# Altium project SDR_PMR.PrjPcb (part 10 of 12)

## Sheet PTT.SchDoc
size A4; SheetNumber: 14; SheetTotal: 18
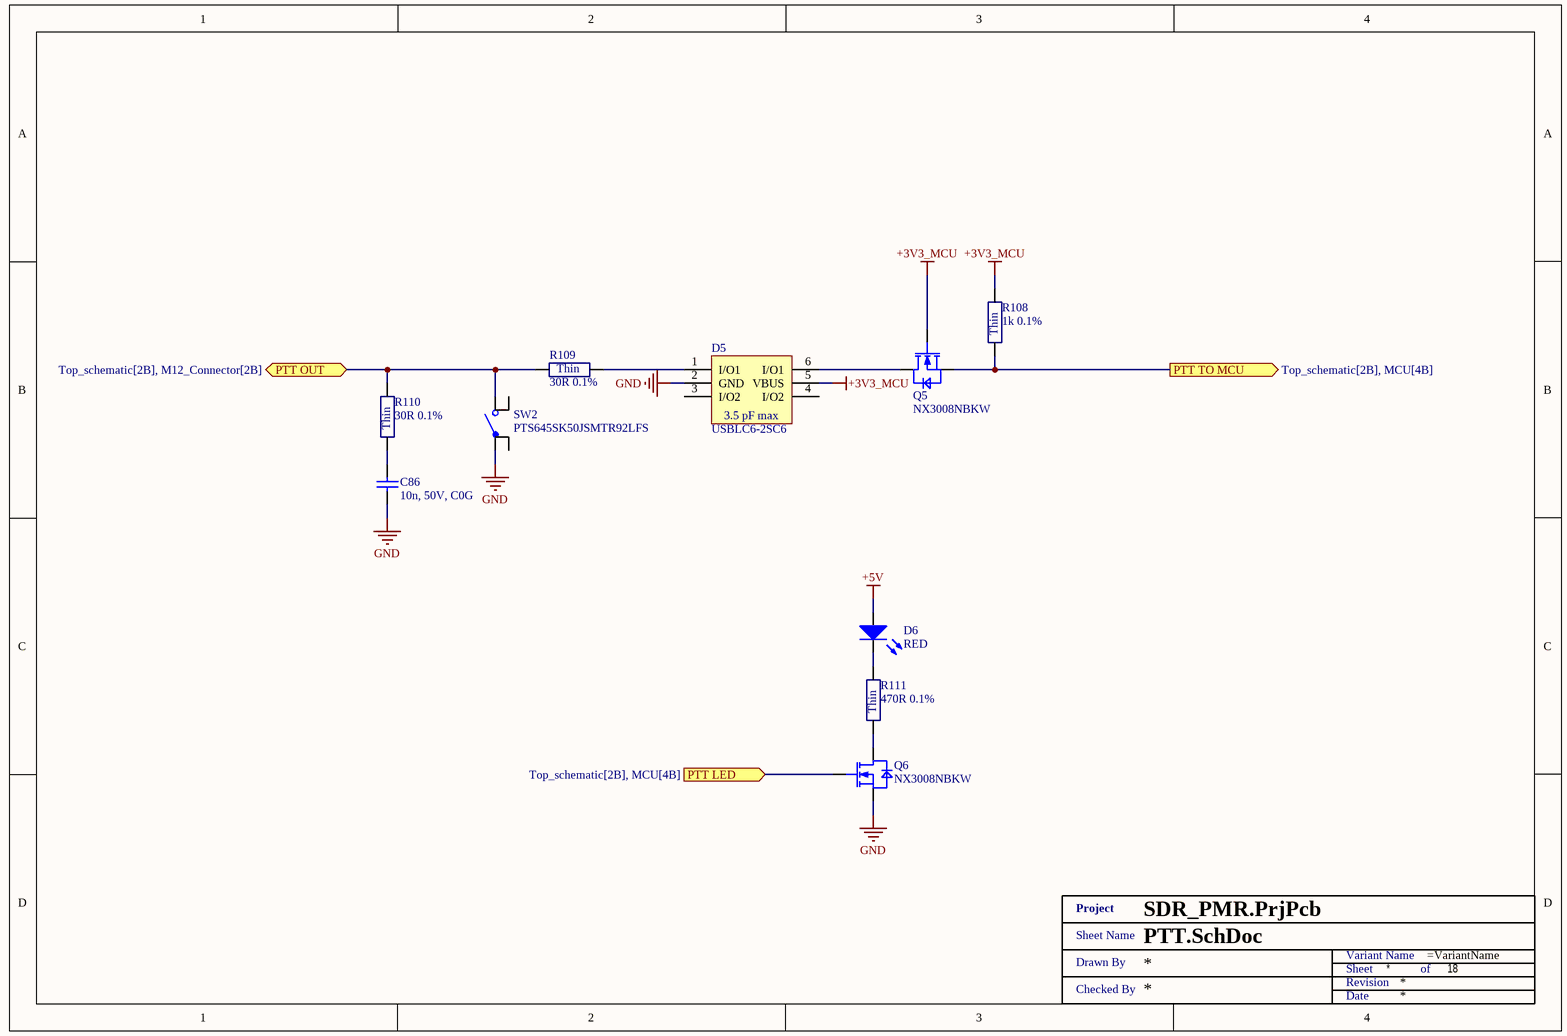
[diagram p13: PTT.SchDoc]

### Parts
(Parts that share a designator on the sheet are numbered #1, #2 ... from top to bottom, then left to right.)
C86  10n, 50V, C0G  [SMD0603]
D5  USBLC6-2SC6  [SOT23-6L]
D6  RED  [MCL-S270]
Q5  NX3008NBKW  [SOT323]
Q6  NX3008NBKW  [SOT323]
R108  1k 0.1%  [SMD0402 - R]
R109  30R 0.1%  [SMD0402 - R]
R110  30R 0.1%  [SMD0402 - R]
R111  470R 0.1%  [SMD0402 - R]
SW2  PTS645SK50JSMTR92LFS  [J Square Actuator 6X6]
XX?#14  Title 1  (value not drawn)  (graphical)

### Ports
PTT LED (in, see Top_schematic[2B], MCU[4B]), PTT OUT (bidir, see Top_schematic[2B], M12_Connector[2B]), PTT TO MCU (out, see Top_schematic[2B], MCU[4B])

### Nets
+3V3_MCU: D5.5(VBUS) Q5.1(G) R108.2
+5V: D6.2(A)
GND: C86.1 D5.2(GND) Q6.2(S) SW2.1(A)
NetC86_2: C86.2 R110.1
NetD5_1: D5.1(I/O1) R109.2
NetD5_6: D5.6(I/O1) Q5.3(D)
NetD6_1: D6.1(K) R111.2
NetQ5_2: Q5.2(S) R108.1 ; port PTT TO MCU
NetQ6_1: Q6.1(G) ; port PTT LED
NetQ6_3: Q6.3(D) R111.1
NetR109_1: R109.1 R110.2 SW2.3(C) ; port PTT OUT

Not connected (* = marked no-connect by the designer): D5 3(I/O2) 4(I/O2); SW2 2(B) 4(D)

### Notes on the sheet
- (in symbol RT0402BRE07470RL) Thin
- (in symbol TC0225B300JTCC) Thin
- (in symbol TC0225B1001TCC) Thin
- (in symbol Title 1) Project; Sheet Name; Variant Name; Drawn By; Sheet; of; Revision; Checked By; Date
- (in symbol USBLC6-2SC6) 3.5 pF max

### Library data of the parts
C86 = GRM1885C1H103JA01D: Multilayer Ceramic Capacitors MLCC - SMD/SMT 0603 50VDC 10000pF 5% C0G; Manufacturer: Murata Electronics; Type: Chip Multilayer Ceramic Capacitor for General Purpose; Capacitance - nF: 10 nF; Class: Class 1; CNHTS: 8532241000; Dielectric: C0G (NP0); TARIC: 8532240000; Supplier 1: Mouser; Supplier Part Number 1: 81-GRM1885C1H103JA1D; Manufacturer Part Number: GRM1885C1H103JA01D; RoHS: RoHS Compliant; Category: Multilayer Ceramic Capacitors MLCC - SMD/SMT; Stock 1: 217291; Pricing 1: 1=0.183, 10=0.129, 100=0.065, 500=0.045, 1000=0.039, 4000=0.030, 8000=0.027, 24000=0.025 (EUR); Capacitance: 10n; Height: 0.8 mm; Length: 1.6 mm; Package / Case: 0603 (1608 metric); Packaging: Cut Tape; Product: General Type MLCCs; Series: GRM; Termination Style: SMD/SMT; Tolerance: 5 %; Voltage Rating DC: 50 VDC; Width: 0.8 mm; Brand: Murata Electronics; Capacitance - pF: 10000 pF; Case Code - in: 0603; Case Code - mm: 1608; HTS Code: 8532240020; Maximum Operating Temperature: + 125 C; Minimum Operating Temperature: - 55 C; Product Type: Ceramic Capacitors; Standard Pack Qty: 4000; Subcategory: Capacitors; Termination: Standard; RoHS - Mouser: Y; Minimum Order Quantity: 1; Reeling: True; ComponentLink1URL: http://www.mouser.com/datasheet/2/281/murata_03052018_GRM_Series_1-1310166.pdf; ComponentLink1Description: http://www.mouser.com/datasheet/2/281/murata_03052018_GRM_Series_1-1310166.pdf; Supplier 2: Farnell; Supplier Part Number 2: 2456107
D5 = USBLC6-2SC6: STMicroelectronics Uni-Directional TVS Diode Array, 17V Vcl Max, SMD, SOT-23, 6V Vbr Min; Value: 2.5pF; Data Rate: 480Mbps; Direction: Unidirectional; Element Configuration: Dual; ESD Protection: Yes; Forward Voltage: 1.1V; Leakage Current: 150nA; Max Junction Temperature (Tj): 125°C; Max Repetitive Reverse Voltage (Vrrm): 5.25V; Number of Bidirectional Channels: 2; Number of Elements: 1; Peak Pulse Current: 5A; Reverse Standoff Voltage: 5V; Test Current: 1mA; Manufacturer: STMicroelectronics; Manufacturer Part Number: USBLC6-2SC6; RoHS: Compliant; Category: TVS Diodes; Pricing 1: 1=0.47, 10=0.292, 50=0.292, 100=0.204, 500=0.131, 1000=0.14, 3000=0.094, 6000=0.085, 9000=0.081, 10000=0.086, 24000=0.073 (USD); Breakdown Voltage: 6V; Case/Package: SOT-23; China RoHS: Compliant; Clamping Voltage: 17V; Contact Plating: Tin; Country of Origin: Mainland China; Depth: 1.75mm; Export Control Classification Number (ECCN) Code: EAR99; Height: 1.45mm; Harmonized Tariff Schedule (HTS) Code: 8541.10.00.50; Introduction Date: 2005-03-15; Lead Free: Lead Free; Length: 3.05mm; Lifecycle Status: Production; Max Breakdown Voltage: 6V; Max Operating Temperature: 125°C; Max Reverse Leakage Current: 150nA; Min Breakdown Voltage: 6V; Min Operating Temperature: -40°C; Mounting Technology: Surface Mount; Number of Channels: 2; Pins: 6; Number of Terminals: 6; Operating Supply Voltage: 1.1V; Peak Reverse Current: 150nA; Polarity: Unidirectional; Power Line Protection: Yes; Radiation Hardening: No; REACH SVHC: Yes; Reverse Breakdown Voltage: 6V; Schedule B: 8536300000, 8536300000|8536300000|8536300000|8536300000|8536300000|8536300000|8536300000|8536300000|8536300000|8536300000|8536300000|8536300000|8536300000|8536300000|8536300000|8536300000|8536300000|8536300000|8536300000|8536300000|8536300000|8536300000|8536300000|85; Termination: SMD/SMT; Width: 1.75mm; Working Voltage: 5V; ComponentLink1URL: https://datasheet.octopart.com:443/USBLC6-2SC6-STMicroelectronics-datasheet-10412581.pdf?src-supplier=Newark; ComponentLink1Description: https://datasheet.octopart.com:443/USBLC6-2SC6-STMicroelectronics-datasheet-10412581.pdf?src-supplier=Newark; ComponentLink2URL: https://datasheet.octopart.com:443/USBLC6-2SC6-STMicroelectronics-datasheet-181961833.pdf?src-supplier=Newark; ComponentLink2Description: https://datasheet.octopart.com:443/USBLC6-2SC6-STMicroelectronics-datasheet-181961833.pdf?src-supplier=Newark; ComponentLink3URL: https://datasheet.octopart.com:443/USBLC6-2SC6-STMicroelectronics-datasheet-525477.pdf?src-supplier=Factory+Futures; ComponentLink3Description: https://datasheet.octopart.com:443/USBLC6-2SC6-STMicroelectronics-datasheet-525477.pdf?src-supplier=Factory+Futures; ComponentLink4URL: https://datasheet.octopart.com:443/USBLC6-2SC6-STMicroelectronics-datasheet-82998616.pdf?src-supplier=Farnell; ComponentLink4Description: https://datasheet.octopart.com:443/USBLC6-2SC6-STMicroelectronics-datasheet-82998616.pdf?src-supplier=Farnell; ComponentLink5URL: https://datasheet.octopart.com:443/USBLC6-2SC6-STMicroelectronics-datasheet-46285.pdf?src-supplier=Farnell; ComponentLink5Description: https://datasheet.octopart.com:443/USBLC6-2SC6-STMicroelectronics-datasheet-46285.pdf?src-supplier=Farnell; ComponentLink6URL: https://datasheet.octopart.com:443/USBLC6-2SC6-STMicroelectronics-datasheet-14050643.pdf?src-supplier=iiiC; ComponentLink6Description: https://datasheet.octopart.com:443/USBLC6-2SC6-STMicroelectronics-datasheet-14050643.pdf?src-supplier=iiiC; ComponentLink7URL: https://datasheet.octopart.com:443/USBLC6-2SC6-STMicroelectronics-datasheet-10521292.pdf?src-supplier=Jameco+(USA); ComponentLink7Description: https://datasheet.octopart.com:443/USBLC6-2SC6-STMicroelectronics-datasheet-10521292.pdf?src-supplier=Jameco+(USA); Supplier 1: Mouser; Supplier Part Number 1: 511-USBLC6-2SC6; Supplier 2: LCSC; Supplier Part Number 2: C2687116
D6 = MCL-S270SRC: MULTICOMP - MCL-S270SRC - LED, SMD, 0805, SUPER-RED; Bulb Size: 1.25mm x 1.4; Forward Current If: 20; Forward Voltage: 1.85; Wavelength Typ: 643; Luminous Intensity: 17; Viewing Angle: 140°; Lens Shape: Rectangular; SVHC: No SVHC (17-Dec-2015); Forward Voltage VF Max: 2.4; LED / Lamp Size: 1.4mm x 1.25; LED Type: Standard; Luminous Intensity Min: 14; No. of Pins: 2; Peak Forward Current: 120; Peak Wavelength: 660; Power Dissipation Pd: 100; Reverse Protection Voltage: 5; Voltage Vf Min: 1.5; Voltage Vf Typ: 1.85V<!--FANDB--><div class="features-and-benefits-container"><div class="features-and-benefits-description"><span class="features-benefits-value">The MCL-S270SRC is a super red SMD LED with water clear epoxy, made of GaAlAs dice.</span></div><div class="features-and-benefits-list"><ul class="features-and-benefits-list-list"><li class="features-and-benefits-list-item">0805 Case</li><li class="features-and-benefits-list-item">5V Reverse voltage</li><li class="features-and-benefits-list-item">10?A at 5V Reverse current</li><li class="features-and-benefits-list-item">-40 to 85; Manufacturer: MULTICOMP; Manufacturer Part Number: MCL-S270SRC; RoHS: YES; Stock 1: 27404; Pricing 1: 5=0,154, 25=0,142, 100=0,132, 250=0,0847, 500=0,0679, 2000=0,0583, 5000=0,0521, 20000=0,0455 (GBP); LED Colour: Red; LED Mounting: SMD; Packaging: Cut Tape; Product Range: -; Automotive Qualification Standard: -; MSL: MSL 3 - 168 hours; Current Rating: 20; Dominant Wavelength: 643; Dominant Wavelength Typ: 643; Forward Current If Max: 20; Luminous Intensity Max: 20; Luminous Intensity Typ: 17; Operating Temperature Max: 85; Operating Temperature Min: -40; Operating Temperature Range: -40°C to +85; Storage Temperature Max: +100; Storage Temperature Min: -40; ComponentLink1URL: http://www.farnell.com/cad/53023.pdf; ComponentLink1Description: http://www.farnell.com/cad/53023.pdf; ComponentLink2URL: http://www.farnell.com/datasheets/2182724.pdf; ComponentLink2Description: http://www.farnell.com/datasheets/2182724.pdf; Supplier 1: Farnell; Supplier Part Number 1: 1581239; Supplier 2: Newark; Supplier Part Number 2: 14N9358
Q5 Q6 = NX3008NBKW: NXP - NX3008NBKW - MOSFET, N CH, 30V, 350MA, SOT323; Transistor Polarity: N Channel; Continuous Drain Current Id: 350; Drain Source Voltage Vds: 30; On Resistance Rds(on): 1; Rds(on) Test Voltage Vgs: 4.5; Threshold Voltage Vgs: 900; Power Dissipation Pd: 260; Transistor Case Style: SOT-323; No. of Pins: 3; SVHC: No SVHC (17-Dec-2015); Pulse Current Idm: -0.8; Voltage Vgs th Max: 8; Manufacturer: NXP; Manufacturer Part Number: NX3008NBKW; RoHS: YES; Stock 1: 4764; Pricing 1: 1=0.0425, 25=0.0385, 100=0.0347, 250=0.0334, 500=0.0312, 2000=0.0291, 4000=0.0282, 20000=0.0273 (GBP); Operating Temperature Max: 150; Product Range: -; Automotive Qualification Standard: -; MSL: MSL 1 - Unlimited; Operating Temperature Min: -55; Operating Temperature Range: -55°C to +150; ComponentLink1URL: http://www.farnell.com/datasheets/1508392.pdf; ComponentLink1Description: http://www.farnell.com/datasheets/1508392.pdf; Supplier 1: Mouser; Supplier Part Number 1: 771-NX3008NBKW,115; Supplier 2: Farnell; Supplier Part Number 2: 2069546; Supplier 3: Arrow; Supplier Part Number 3: NX3008NBKW,115
R108 = TC0225B1001TCC: 62.5mW Thin Film Resistor 25V ±25ppm/℃ ±0.1% 1kΩ 0402 Chip Resistor - Surface Mount ROHS; Manufacturer: Uniroyal; Working Voltage: 50V; Supplier 1: LCSC; Supplier Part Number 1: C2989674; Manufacturer Part Number: TC0225B1001TCC; Category: Chip SMD Resistors; Stock 1: 12060; Pricing 1: 20=0.036, 200=0.031, 600=0.0283, 2000=0.0267, 10000=0.0252, 20000=0.0245 (USD); Case/Package: 0402; Composition: Thin Film; Export Control Classification Number (ECCN) Code: EAR99; Height: 300µm; Harmonized Tariff Schedule (HTS) Code: 8533.21.00.30; Length: 1mm; Lifecycle Status: Production; Max Operating Temperature: 155°C; Min Operating Temperature: -55°C; Mounting Technology: Surface Mount; Number of Terminals: 2; Power Rating: 62.5mW; Resistance: 1k; Tolerance: 0.1%; Width: 500µm; ComponentLink1URL: https://datasheet.octopart.com:443/TC0225B1001TCC-Uniroyal-datasheet-194228365.pdf?src-supplier=LCSC; ComponentLink1Description: https://datasheet.octopart.com:443/TC0225B1001TCC-Uniroyal-datasheet-194228365.pdf?src-supplier=LCSC
R109 R110 = TC0225B300JTCC: as R88-R96 on sheet MCU; Supplier 1: LCSC; Supplier Part Number 1: C50670254; Manufacturer Part Number: TC0225B300JTCC; Category: Uncategorized; Stock 1: 4950; Pricing 1: 50=0.0203, 500=0.0161, 1500=0.0137, 10000=0.0123, 20000=0.0111, 50000=0.0104 (USD); ComponentLink1URL: https://datasheet.octopart.com:443/TC0225B300JTCC-Uniroyal-datasheet-194228366.pdf?src-supplier=LCSC; ComponentLink1Description: https://datasheet.octopart.com:443/TC0225B300JTCC-Uniroyal-datasheet-194228366.pdf?src-supplier=LCSC; Resistance: 30R
R111 = RT0402BRE07470RL: Fixed Resistor, Thin Film, 0.0625W, 470ohm, 50V, 0.1% +/-Tol, 50ppm/Cel, Surface Mount, 0402; Manufacturer: Yageo Group; Power Rating: 62.5mW; Temperature Coefficient: 50ppm/°C; Supplier: Mouser; Supplier Part Number: 603-RT0402BRE07470RL; Manufacturer Part Number: RT0402BRE07470RL; RoHS: Compliant; Category: Chip SMD Resistors; Pricing: 1=0,4, 10=0,205, 50=0,205, 100=0,121, 1000=0,079, 10000=0,052 (USD); Case/Package: 0402; Case Code (Metric): 0402; China RoHS: Non-Compliant; Composition: Thin Film; Country of Origin: Mainland China; Export Control Classification Number (ECCN) Code: EAR99; Height: 300µm; Harmonized Tariff Schedule (HTS) Code: 8533.21.00.30; Introduction Date: 2008-07-11; Lead Free: Lead Free; Length: 1mm; Lifecycle Status: Production; Max Operating Temperature: 155°C; Min Operating Temperature: -55°C; Mounting Technology: Surface Mount; Number of Terminals: 2; REACH SVHC: Yes; Resistance: 470R; Tolerance: 0.1%; Voltage Rating: 50V; Voltage Rating (DC): 50V; Width: 500µm; Working Voltage: 50V; ComponentLink1URL: https://datasheet.octopart.com:443/RT0402BRE07470RL-Yageo-datasheet-176402239.pdf?src-supplier=IHS; ComponentLink1Description: https://datasheet.octopart.com:443/RT0402BRE07470RL-Yageo-datasheet-176402239.pdf?src-supplier=IHS; ComponentLink2URL: https://datasheet.octopart.com:443/RT0402BRE07470RL-Yageo-datasheet-96443642.pdf?src-supplier=Upverter; ComponentLink2Description: https://datasheet.octopart.com:443/RT0402BRE07470RL-Yageo-datasheet-96443642.pdf?src-supplier=Upverter; ComponentLink3URL: https://datasheet.octopart.com:443/RT0402BRE07470RL-Yageo-Group-datasheet-188167888.pdf?src-supplier=LCSC; ComponentLink3Description: https://datasheet.octopart.com:443/RT0402BRE07470RL-Yageo-Group-datasheet-188167888.pdf?src-supplier=LCSC; ComponentLink4URL: https://datasheet.octopart.com:443/RT0402BRE07470RL-Yageo-Group-datasheet-141265893.pdf?src-supplier=ODG+(Origin+Data+Global); ComponentLink4Description: https://datasheet.octopart.com:443/RT0402BRE07470RL-Yageo-Group-datasheet-141265893.pdf?src-supplier=ODG+(Origin+Data+Global); ComponentLink5URL: https://datasheet.octopart.com/RT0402BRE07470RL-Yageo-datasheet-86813807.pdf; ComponentLink5Description: https://datasheet.octopart.com/RT0402BRE07470RL-Yageo-datasheet-86813807.pdf; ComponentLink6URL: http://sigma.octopart.com:80/conflict_mineral_statement/Yageo-company-3.pdf?src-supplier=Compliance+Statements; ComponentLink6Description: http://sigma.octopart.com:80/conflict_mineral_statement/Yageo-company-3.pdf?src-supplier=Compliance+Statements; ComponentLink7URL: http://sigma.octopart.com:80/rohs_statement/Yageo-company-2.pdf?src-supplier=Compliance+Statements; ComponentLink7Description: http://sigma.octopart.com:80/rohs_statement/Yageo-company-2.pdf?src-supplier=Compliance+Statements; Supplier 1: Mouser; Supplier Part Number 1: 603-RT0402BRE07470RL; Supplier 2: LCSC; Supplier Part Number 2: C853290
SW2 = PTS645SK50JSMTR92LFS: Switch Tactile SPST N.O Round Button 12V 50mA 2.5N Solder Surface Mount T/R; Manufacturer: C&K Components; Supplier: Mouser; Supplier Part Number: 611-SK50JSMTR92LFS; Manufacturer Part Number: PTS645SK50JSMTR92LFS; RoHS: Compliant; Category: Tactile Switches; Stock: 6240; Pricing: 1=0,51, 10=0,437, 50=0,408, 100=0,364, 1000=0,268, 10000=0,234 (USD); Export Control Classification Number (ECCN) Code: EAR99; Harmonized Tariff Schedule (HTS) Code: 8536.50.70.00; Introduction Date: 2022-04-14; Lifecycle Status: Production; REACH SVHC: Yes; ComponentLink1URL: https://datasheet.octopart.com:443/PTS645SK50JSMTR92LFS-C%26K-Components-datasheet-169841344.pdf?src-supplier=IHS; ComponentLink1Description: https://datasheet.octopart.com:443/PTS645SK50JSMTR92LFS-C%26K-Components-datasheet-169841344.pdf?src-supplier=IHS; ComponentLink2URL: https://datasheet.octopart.com:443/PTS645SK50JSMTR92LFS-C%26K-Components-datasheet-165782998.pdf?src-supplier=Farnell; ComponentLink2Description: https://datasheet.octopart.com:443/PTS645SK50JSMTR92LFS-C%26K-Components-datasheet-165782998.pdf?src-supplier=Farnell; ComponentLink3URL: https://datasheet.octopart.com:443/PTS645SK50JSMTR92LFS-C%26K-Components-datasheet-155912617.pdf?src-supplier=Sager+Electronics; ComponentLink3Description: https://datasheet.octopart.com:443/PTS645SK50JSMTR92LFS-C%26K-Components-datasheet-155912617.pdf?src-supplier=Sager+Electronics; ComponentLink4URL: https://datasheet.octopart.com:443/PTS645SK50JSMTR92LFS-C%26K-Components-datasheet-150821959.pdf?src-supplier=Sager+Electronics; ComponentLink4Description: https://datasheet.octopart.com:443/PTS645SK50JSMTR92LFS-C%26K-Components-datasheet-150821959.pdf?src-supplier=Sager+Electronics; ComponentLink5URL: https://datasheet.octopart.com:443/PTS645SK50JSMTR92LFS-C%26K-Components-datasheet-67873720.pdf?src-supplier=Sager+Electronics; ComponentLink5Description: https://datasheet.octopart.com:443/PTS645SK50JSMTR92LFS-C%26K-Components-datasheet-67873720.pdf?src-supplier=Sager+Electronics; ComponentLink6URL: http://sigma.octopart.com:80/reach_statement/ITT-company-18.pdf?src-supplier=Compliance+Statements; ComponentLink6Description: http://sigma.octopart.com:80/reach_statement/ITT-company-18.pdf?src-supplier=Compliance+Statements; Supplier 1: Mouser; Supplier Part Number 1: 611-SK50JSMTR92LFS; Supplier 2: Farnell; Supplier Part Number 2: PTS645SK50JSMTR92LFS

## Sheet USB_connector.SchDoc
size A4; SheetNumber: 16; SheetTotal: 18
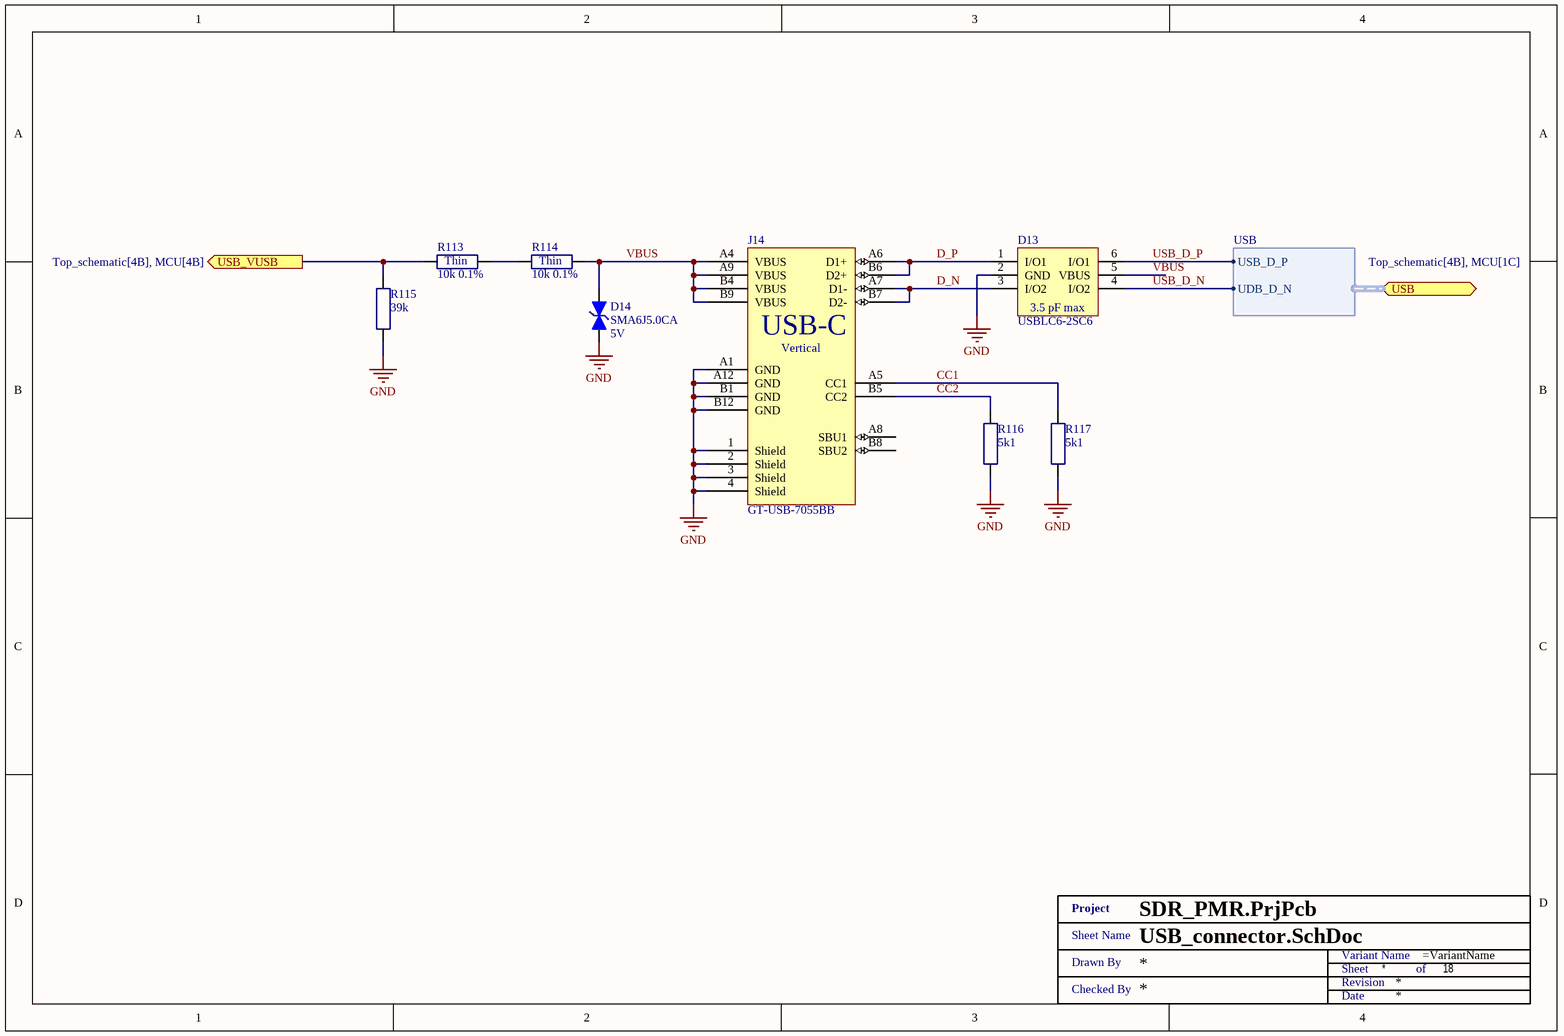
[diagram p14: USB_connector.SchDoc]

### Parts
(Parts that share a designator on the sheet are numbered #1, #2 ... from top to bottom, then left to right.)
D13  USBLC6-2SC6  [SOT23-6L]
D14  SMA6J5.0CA  Reverse Standoff Voltage: 5V  [DO-214AC]
J14  GT-USB-7055BB  [GT-USB-7055BB]
R113  10k 0.1%  [SMD0402 - R]
R114  10k 0.1%  [SMD0402 - R]
R115  39k  [SMD0402 - R]
R116  5k1  [SMD0402 - R]
R117  5k1  [SMD0402 - R]
XX?#15  Title 1  (value not drawn)  (graphical)

### Ports
USB (bidir, harness USB, see Top_schematic[4B], MCU[1C]), USB_VUSB (out, see Top_schematic[4B], MCU[4B])

### Harnesses
USB: UDB_D_N, USB_D_P

### Nets
GND: D13.2(GND) D14.1(A) J14.1(Shield) J14.2(Shield) J14.3(Shield) J14.4(Shield) J14.A1(GND) J14.A12(GND) J14.B1(GND) J14.B12(GND) R115.1 R116.1 R117.1
CC1: J14.A5(CC1) R117.2
CC2: J14.B5(CC2) R116.2
D_N: D13.3(I/O2) J14.A7(D1-) J14.B7(D2-)
D_P: D13.1(I/O1) J14.A6(D1+) J14.B6(D2+)
USB_D_N: D13.4(I/O2) ; port USB.UDB_D_N
USB_D_P: D13.6(I/O1) ; port USB.USB_D_P
USB_VUSB: R113.1 R115.2 ; port USB_VUSB
VBUS: D13.5(VBUS) D14.2(K) J14.A4(VBUS) J14.A9(VBUS) J14.B4(VBUS) J14.B9(VBUS) R114.2
NetR113_2: R113.2 R114.1

Not connected (* = marked no-connect by the designer): J14 A8(SBU1) B8(SBU2)

### Notes on the sheet
- (in symbol GT-USB-7055BB) USB-C; Vertical
- (in symbol TC0225B1002TCC) Thin
- (in symbol Title 1) Project; Sheet Name; Variant Name; Drawn By; Sheet; of; Revision; Checked By; Date
- (in symbol USBLC6-2SC6) 3.5 pF max

### Library data of the parts
D13 = USBLC6-2SC6: as D5 on sheet PTT; Manufacturer: STMicroelectronics; Manufacturer Part Number: USBLC6-2SC6; RoHS: Compliant; Category: TVS Diodes; Pricing 1: 1=0.47, 10=0.292, 50=0.292, 100=0.204, 500=0.131, 1000=0.14, 3000=0.094, 6000=0.085, 9000=0.081, 10000=0.086, 24000=0.073 (USD); Breakdown Voltage: 6V; Case/Package: SOT-23; China RoHS: Compliant; Clamping Voltage: 17V; Contact Plating: Tin; Country of Origin: Mainland China; Depth: 1.75mm; Export Control Classification Number (ECCN) Code: EAR99; Height: 1.45mm; Harmonized Tariff Schedule (HTS) Code: 8541.10.00.50; Introduction Date: 2005-03-15; Lead Free: Lead Free; Length: 3.05mm; Lifecycle Status: Production; Max Breakdown Voltage: 6V; Max Operating Temperature: 125°C; Max Reverse Leakage Current: 150nA; Min Breakdown Voltage: 6V; Min Operating Temperature: -40°C; Mounting Technology: Surface Mount; Number of Channels: 2; Pins: 6; Number of Terminals: 6; Operating Supply Voltage: 1.1V; Peak Reverse Current: 150nA; Polarity: Unidirectional; Power Line Protection: Yes; Radiation Hardening: No; REACH SVHC: Yes; Reverse Breakdown Voltage: 6V; Schedule B: 8536300000, 8536300000|8536300000|8536300000|8536300000|8536300000|8536300000|8536300000|8536300000|8536300000|8536300000|8536300000|8536300000|8536300000|8536300000|8536300000|8536300000|8536300000|8536300000|8536300000|8536300000|8536300000|8536300000|8536300000|85; Termination: SMD/SMT; Width: 1.75mm; Working Voltage: 5V; ComponentLink1URL: https://datasheet.octopart.com:443/USBLC6-2SC6-STMicroelectronics-datasheet-10412581.pdf?src-supplier=Newark; ComponentLink1Description: https://datasheet.octopart.com:443/USBLC6-2SC6-STMicroelectronics-datasheet-10412581.pdf?src-supplier=Newark; ComponentLink2URL: https://datasheet.octopart.com:443/USBLC6-2SC6-STMicroelectronics-datasheet-181961833.pdf?src-supplier=Newark; ComponentLink2Description: https://datasheet.octopart.com:443/USBLC6-2SC6-STMicroelectronics-datasheet-181961833.pdf?src-supplier=Newark; ComponentLink3URL: https://datasheet.octopart.com:443/USBLC6-2SC6-STMicroelectronics-datasheet-525477.pdf?src-supplier=Factory+Futures; ComponentLink3Description: https://datasheet.octopart.com:443/USBLC6-2SC6-STMicroelectronics-datasheet-525477.pdf?src-supplier=Factory+Futures; ComponentLink4URL: https://datasheet.octopart.com:443/USBLC6-2SC6-STMicroelectronics-datasheet-82998616.pdf?src-supplier=Farnell; ComponentLink4Description: https://datasheet.octopart.com:443/USBLC6-2SC6-STMicroelectronics-datasheet-82998616.pdf?src-supplier=Farnell; ComponentLink5URL: https://datasheet.octopart.com:443/USBLC6-2SC6-STMicroelectronics-datasheet-46285.pdf?src-supplier=Farnell; ComponentLink5Description: https://datasheet.octopart.com:443/USBLC6-2SC6-STMicroelectronics-datasheet-46285.pdf?src-supplier=Farnell; ComponentLink6URL: https://datasheet.octopart.com:443/USBLC6-2SC6-STMicroelectronics-datasheet-14050643.pdf?src-supplier=iiiC; ComponentLink6Description: https://datasheet.octopart.com:443/USBLC6-2SC6-STMicroelectronics-datasheet-14050643.pdf?src-supplier=iiiC; ComponentLink7URL: https://datasheet.octopart.com:443/USBLC6-2SC6-STMicroelectronics-datasheet-10521292.pdf?src-supplier=Jameco+(USA); ComponentLink7Description: https://datasheet.octopart.com:443/USBLC6-2SC6-STMicroelectronics-datasheet-10521292.pdf?src-supplier=Jameco+(USA); Supplier 1: Mouser; Supplier Part Number 1: 511-USBLC6-2SC6; Supplier 2: LCSC; Supplier Part Number 2: C2687116
D14 = SMA6J5.0CA: ESD Suppressors / TVS Diodes 600W 5V 5% Bi-Directional; Manufacturer: Littelfuse; Supplier 1: Mouser; Supplier Part Number 1: 576-SMA6J5.0CA; Manufacturer Part Number: SMA6J5.0CA; RoHS: Yes; Category: TVS Diodes; Stock 1: 57321; Pricing 1: 1=0.41, 10=0.35, 50=0.35, 100=0.243, 1000=0.139, 10000=0.115 (USD); ComponentLink1URL: http://www.farnell.com/datasheets/2736094.pdf?src-supplier=Farnell; ComponentLink1Description: http://www.farnell.com/datasheets/2736094.pdf?src-supplier=Farnell; ComponentLink2URL: https://datasheet.octopart.com/SMA6J5.0CA-Littelfuse-datasheet-114785799.pdf?src-supplier=Future+Electronics; ComponentLink2Description: https://datasheet.octopart.com/SMA6J5.0CA-Littelfuse-datasheet-114785799.pdf?src-supplier=Future+Electronics; ComponentLink3URL: https://www.littelfuse.com/~/media/electronics/datasheets/tvs_diodes/littelfuse_tvs_diode_sma6j_datasheet.pdf.pdf?src-supplier=Digi-Key; ComponentLink3Description: https://www.littelfuse.com/~/media/electronics/datasheets/tvs_diodes/littelfuse_tvs_diode_sma6j_datasheet.pdf.pdf?src-supplier=Digi-Key; ComponentLink4URL: http://www.farnell.com/datasheets/2736094.pdf?src-supplier=Newark; ComponentLink4Description: http://www.farnell.com/datasheets/2736094.pdf?src-supplier=Newark; ComponentLink5URL: http://www.farnell.com/datasheets/2736094.pdf?src-supplier=Element14; ComponentLink5Description: http://www.farnell.com/datasheets/2736094.pdf?src-supplier=Element14; Supplier 2: Farnell; Supplier Part Number 2: 3010381; Supplier 3: Digi-Key; Supplier Part Number 3: 18-SMA6J5.0CACT-ND
J14 = GT-USB-7055BB: CONN RCPT USB 2.0 Type-C 16POS SMD; Supplier 1: LCSC; Supplier Part Number 1: C7450621
R113 R114 = TC0225B1002TCC: Fixed Resistor, Thin Film, 0.0625W, 10000ohm, 50V, 0.1% +/-Tol, Surface Mount, 0402; Manufacturer: Uniroyal; Power Rating: 62.5mW; Supplier 1: LCSC; Supplier Part Number 1: C2989267; Manufacturer Part Number: TC0225B1002TCC; Category: Chip SMD Resistors; Stock 1: 10200; Pricing 1: 20=0.0396, 200=0.0352, 600=0.0327, 2000=0.0312, 10000=0.0299, 20000=0.0292 (USD); Case/Package: 0402; Composition: Thin Film; Export Control Classification Number (ECCN) Code: EAR99; Height: 300µm; Harmonized Tariff Schedule (HTS) Code: 8533.21.00.30; Length: 1mm; Lifecycle Status: Production; Max Operating Temperature: 155°C; Min Operating Temperature: -55°C; Mounting Technology: Surface Mount; Number of Terminals: 2; Resistance: 10k; Tolerance: 0.1%; Width: 500µm; Working Voltage: 50V; ComponentLink1URL: https://datasheet.octopart.com:443/TC0225B1002TCC-Uniroyal-datasheet-194228365.pdf?src-supplier=LCSC; ComponentLink1Description: https://datasheet.octopart.com:443/TC0225B1002TCC-Uniroyal-datasheet-194228365.pdf?src-supplier=LCSC
R115 = RC0402FR-0739KL: Res Thick Film 0402 39K Ohm 1% 0.063W(1/16W) ±100ppm/C Pad SMD T/R; Manufacturer: Yageo Group; Max Power Dissipation: 63mW; Power Rating: 62.5mW; Temperature Coefficient: 100ppm/°C; Voltage Rating: 50V; Supplier 1: Mouser; Supplier Part Number 1: 603-RC0402FR-0739KL; Manufacturer Part Number: RC0402FR-0739KL; RoHS: Compliant; Category: Chip SMD Resistors; Stock 1: 313189; Pricing 1: 1=0.1, 10=0.011, 50=0.011, 100=0.006, 1000=0.006, 10000=0.002 (USD); Case/Package: 0402; Case Code (Imperial): 0402; China RoHS: Non-Compliant; Composition: Thick Film; Depth: 500µm; Features: Moisture Resistant; Height: 350µm; Lead Free: Lead Free; Length: 1mm; Lifecycle Status: Production; Max Operating Temperature: 155°C; Military Standard: Not; Min Operating Temperature: -55°C; Mounting Technology: Surface Mount; Pins: 2; Number of Terminals: 2; Number of Terminations: 2; REACH SVHC: Yes; Resistance: 39k; Schedule B: 8533210045, 8533210045|8533210045, 8533210045|8533210045|8533210045, 8533210045|8533210045|8533210045|8533210045; Termination: SMD/SMT; Tolerance: 1%; Voltage Rating (AC): 50V; Voltage Rating (DC): 50V; Width: 500µm; Working Voltage: 50V; ComponentLink1URL: https://datasheet.octopart.com:443/RC0402FR-0739KL-Yageo-datasheet-175887523.pdf?src-supplier=IHS; ComponentLink1Description: https://datasheet.octopart.com:443/RC0402FR-0739KL-Yageo-datasheet-175887523.pdf?src-supplier=IHS; ComponentLink2URL: https://datasheet.octopart.com:443/RC0402FR-0739KL-Yageo-datasheet-103092701.pdf?src-supplier=Upverter; ComponentLink2Description: https://datasheet.octopart.com:443/RC0402FR-0739KL-Yageo-datasheet-103092701.pdf?src-supplier=Upverter; ComponentLink3URL: https://datasheet.octopart.com:443/RC0402FR-0739KL-Yageo-Group-datasheet-190305687.pdf?src-supplier=Newark; ComponentLink3Description: https://datasheet.octopart.com:443/RC0402FR-0739KL-Yageo-Group-datasheet-190305687.pdf?src-supplier=Newark; ComponentLink4URL: https://datasheet.octopart.com:443/RC0402FR-0739KL-Yageo-datasheet-8324527.pdf?src-supplier=Newark; ComponentLink4Description: https://datasheet.octopart.com:443/RC0402FR-0739KL-Yageo-datasheet-8324527.pdf?src-supplier=Newark; ComponentLink5URL: https://datasheet.octopart.com:443/RC0402FR-0739KL-Yageo-datasheet-10408619.pdf?src-supplier=element14+APAC; ComponentLink5Description: https://datasheet.octopart.com:443/RC0402FR-0739KL-Yageo-datasheet-10408619.pdf?src-supplier=element14+APAC; ComponentLink6URL: https://datasheet.octopart.com:443/RC0402FR-0739KL-Yageo-datasheet-62067350.pdf?src-supplier=element14+APAC; ComponentLink6Description: https://datasheet.octopart.com:443/RC0402FR-0739KL-Yageo-datasheet-62067350.pdf?src-supplier=element14+APAC; ComponentLink7URL: https://datasheet.octopart.com:443/RC0402FR-0739KL-Yageo-datasheet-176638170.pdf?src-supplier=Future+Electronics; ComponentLink7Description: https://datasheet.octopart.com:443/RC0402FR-0739KL-Yageo-datasheet-176638170.pdf?src-supplier=Future+Electronics; ComponentLink8URL: https://datasheet.octopart.com:443/RC0402FR-0739KL-Yageo-datasheet-164759695.pdf?src-supplier=Future+Electronics; ComponentLink8Description: https://datasheet.octopart.com:443/RC0402FR-0739KL-Yageo-datasheet-164759695.pdf?src-supplier=Future+Electronics; ComponentLink9URL: https://datasheet.octopart.com:443/RC0402FR-0739KL-Yageo-datasheet-137700087.pdf?src-supplier=Future+Electronics; ComponentLink9Description: https://datasheet.octopart.com:443/RC0402FR-0739KL-Yageo-datasheet-137700087.pdf?src-supplier=Future+Electronics; ComponentLink10URL: https://datasheet.octopart.com:443/RC0402FR-0739KL-Yageo-datasheet-12531192.pdf?src-supplier=Future+Electronics; ComponentLink10Description: https://datasheet.octopart.com:443/RC0402FR-0739KL-Yageo-datasheet-12531192.pdf?src-supplier=Future+Electronics; ComponentLink11URL: https://datasheet.octopart.com:443/RC0402FR-0739KL-Yageo-datasheet-148775077.pdf?src-supplier=TME; ComponentLink11Description: https://datasheet.octopart.com:443/RC0402FR-0739KL-Yageo-datasheet-148775077.pdf?src-supplier=TME; ComponentLink12URL: https://datasheet.octopart.com:443/RC0402FR-0739KL-Yageo-datasheet-79472498.pdf?src-supplier=Megastar; ComponentLink12Description: https://datasheet.octopart.com:443/RC0402FR-0739KL-Yageo-datasheet-79472498.pdf?src-supplier=Megastar; ComponentLink13URL: https://datasheet.octopart.com/RC0402FR-0739KL-Yageo-datasheet-73766026.pdf; ComponentLink13Description: https://datasheet.octopart.com/RC0402FR-0739KL-Yageo-datasheet-73766026.pdf; ComponentLink14URL: https://datasheet.octopart.com:443/RC0402FR-0739KL-Yageo-datasheet-8329306.pdf?src-supplier=element14; ComponentLink14Description: https://datasheet.octopart.com:443/RC0402FR-0739KL-Yageo-datasheet-8329306.pdf?src-supplier=element14; ComponentLink15URL: http://sigma.octopart.com:80/conflict_mineral_statement/Yageo-company-3.pdf?src-supplier=Compliance+Statements; ComponentLink15Description: http://sigma.octopart.com:80/conflict_mineral_statement/Yageo-company-3.pdf?src-supplier=Compliance+Statements; ComponentLink16URL: http://sigma.octopart.com:80/rohs_statement/Yageo-company-2.pdf?src-supplier=Compliance+Statements; ComponentLink16Description: http://sigma.octopart.com:80/rohs_statement/Yageo-company-2.pdf?src-supplier=Compliance+Statements; Supplier Part Number 2: C137995; Supplier 2: LCSC
R116 R117 = RC0402FR-075K1L: 62.5mW Thick Film Resistors 50V ±100ppm/℃ ±1% 5.1kΩ 0402 Chip Resistor - Surface Mount ROHS; Manufacturer: Yageo Group; Max Power Dissipation: 63mW; Temperature Coefficient: 100ppm/°C; Supplier 1: Mouser; Supplier Part Number 1: 603-RC0402FR-075K1L; Manufacturer Part Number: RC0402FR-075K1L; RoHS: Compliant; Category: Chip SMD Resistors; Stock 1: 189513; Pricing 1: 1=0.1, 10=0.009, 50=0.009, 100=0.007, 1000=0.006, 10000=0.002 (USD); Case/Package: 0402; Case Code (Imperial): 0402; China RoHS: Non-Compliant; Composition: Thick Film; Country of Origin: Mainland China, Taiwan; Depth: 500µm; Export Control Classification Number (ECCN) Code: EAR99; Features: Moisture Resistant; Height: 350µm; Harmonized Tariff Schedule (HTS) Code: 8533.21.00.30; Introduction Date: 2008-07-18; Lead Free: Lead Free; Length: 1mm; Lifecycle Status: Production; Max Operating Temperature: 155°C; Military Standard: Not; Min Operating Temperature: -55°C; Mounting Technology: Surface Mount; Pins: 2; Number of Terminals: 2; Number of Terminations: 2; Packaging: Cut Tape; Power Rating: 62.5mW; REACH SVHC: Yes; Resistance: 5k1; Schedule B: 8533210045, 8533210045|8533210045, 8533210045|8533210045|8533210045, 8533210045|8533210045|8533210045|8533210045; Termination: SMD/SMT; Tolerance: 1%; Voltage Rating: 50V; Voltage Rating (DC): 50V; Width: 500µm; Working Voltage: 50V; ComponentLink1URL: https://datasheet.octopart.com:443/RC0402FR-075K1L-Yageo-datasheet-175887523.pdf?src-supplier=IHS; ComponentLink1Description: https://datasheet.octopart.com:443/RC0402FR-075K1L-Yageo-datasheet-175887523.pdf?src-supplier=IHS; ComponentLink2URL: https://datasheet.octopart.com:443/RC0402FR-075K1L-Yageo-datasheet-103092701.pdf?src-supplier=Upverter; ComponentLink2Description: https://datasheet.octopart.com:443/RC0402FR-075K1L-Yageo-datasheet-103092701.pdf?src-supplier=Upverter; ComponentLink3URL: https://datasheet.octopart.com:443/RC0402FR-075K1L-Yageo-Group-datasheet-190305687.pdf?src-supplier=Future+Electronics; ComponentLink3Description: https://datasheet.octopart.com:443/RC0402FR-075K1L-Yageo-Group-datasheet-190305687.pdf?src-supplier=Future+Electronics; ComponentLink4URL: https://datasheet.octopart.com:443/RC0402FR-075K1L-Yageo-datasheet-164759695.pdf?src-supplier=Future+Electronics; ComponentLink4Description: https://datasheet.octopart.com:443/RC0402FR-075K1L-Yageo-datasheet-164759695.pdf?src-supplier=Future+Electronics; ComponentLink5URL: https://datasheet.octopart.com:443/RC0402FR-075K1L-Yageo-datasheet-137700087.pdf?src-supplier=Future+Electronics; ComponentLink5Description: https://datasheet.octopart.com:443/RC0402FR-075K1L-Yageo-datasheet-137700087.pdf?src-supplier=Future+Electronics; ComponentLink6URL: https://datasheet.octopart.com:443/RC0402FR-075K1L-Yageo-datasheet-12531192.pdf?src-supplier=Future+Electronics; ComponentLink6Description: https://datasheet.octopart.com:443/RC0402FR-075K1L-Yageo-datasheet-12531192.pdf?src-supplier=Future+Electronics; ComponentLink7URL: https://datasheet.octopart.com:443/RC0402FR-075K1L-Yageo-datasheet-505231.pdf?src-supplier=Future+Electronics; ComponentLink7Description: https://datasheet.octopart.com:443/RC0402FR-075K1L-Yageo-datasheet-505231.pdf?src-supplier=Future+Electronics; ComponentLink8URL: https://datasheet.octopart.com:443/RC0402FR-075K1L-Yageo-datasheet-10408619.pdf?src-supplier=Newark; ComponentLink8Description: https://datasheet.octopart.com:443/RC0402FR-075K1L-Yageo-datasheet-10408619.pdf?src-supplier=Newark; ComponentLink9URL: https://datasheet.octopart.com:443/RC0402FR-075K1L-Yageo-datasheet-8324527.pdf?src-supplier=Newark; ComponentLink9Description: https://datasheet.octopart.com:443/RC0402FR-075K1L-Yageo-datasheet-8324527.pdf?src-supplier=Newark; ComponentLink10URL: https://datasheet.octopart.com:443/RC0402FR-075K1L-Yageo-datasheet-62067350.pdf?src-supplier=element14+APAC; ComponentLink10Description: https://datasheet.octopart.com:443/RC0402FR-075K1L-Yageo-datasheet-62067350.pdf?src-supplier=element14+APAC; ComponentLink11URL: https://datasheet.octopart.com:443/RC0402FR-075K1L-Yageo-Group-datasheet-189192902.pdf?src-supplier=LCSC; ComponentLink11Description: https://datasheet.octopart.com:443/RC0402FR-075K1L-Yageo-Group-datasheet-189192902.pdf?src-supplier=LCSC; ComponentLink12URL: https://datasheet.octopart.com:443/RC0402FR-075K1L-Yageo-datasheet-148775077.pdf?src-supplier=TME; ComponentLink12Description: https://datasheet.octopart.com:443/RC0402FR-075K1L-Yageo-datasheet-148775077.pdf?src-supplier=TME; ComponentLink13URL: https://datasheet.octopart.com/RC0402FR-075K1L-Yageo-datasheet-73766026.pdf; ComponentLink13Description: https://datasheet.octopart.com/RC0402FR-075K1L-Yageo-datasheet-73766026.pdf; ComponentLink14URL: https://datasheet.octopart.com:443/RC0402FR-075K1L-Yageo-datasheet-8329306.pdf?src-supplier=element14; ComponentLink14Description: https://datasheet.octopart.com:443/RC0402FR-075K1L-Yageo-datasheet-8329306.pdf?src-supplier=element14; ComponentLink15URL: http://sigma.octopart.com:80/conflict_mineral_statement/Yageo-company-3.pdf?src-supplier=Compliance+Statements; ComponentLink15Description: http://sigma.octopart.com:80/conflict_mineral_statement/Yageo-company-3.pdf?src-supplier=Compliance+Statements; ComponentLink16URL: http://sigma.octopart.com:80/rohs_statement/Yageo-company-2.pdf?src-supplier=Compliance+Statements; ComponentLink16Description: http://sigma.octopart.com:80/rohs_statement/Yageo-company-2.pdf?src-supplier=Compliance+Statements; Supplier 2: LCSC; Supplier Part Number 2: C105872